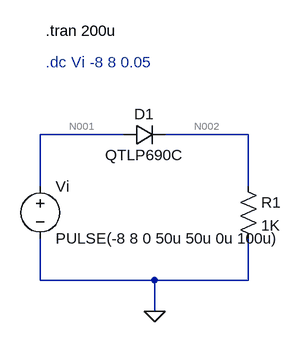
[diagram p0: schematic 114.asc]
114.asc, the LTspice schematic file:
Version 4.1
SHEET 1 880 680
WIRE 192 96 64 96
WIRE 384 96 256 96
WIRE 64 176 64 96
WIRE 384 176 384 96
WIRE 64 320 64 256
WIRE 240 320 64 320
WIRE 384 320 384 256
WIRE 384 320 240 320
WIRE 240 368 240 320
FLAG 240 368 0
SYMBOL diode 192 80 M90
WINDOW 0 0 32 VBottom 2
WINDOW 3 32 32 VTop 2
SYMATTR InstName D1
SYMATTR Value QTLP690C
SYMATTR Description Diode
SYMATTR Type diode
SYMBOL res 368 160 R0
SYMATTR InstName R1
SYMATTR Value 1K
SYMBOL voltage 64 160 R0
WINDOW 123 0 0 Left 0
WINDOW 39 0 0 Left 0
SYMATTR InstName Vi
SYMATTR Value PULSE(-8 8 0 50u 50u 0u 100u)
TEXT 72 -64 Left 2 !.tran 200u
TEXT 72 -16 Left 2 ;.dc Vi -8 8 0.05

The netlist it stands for:
* 114.asc
D1 N001 N002 QTLP690C
R1 N002 0 1K
Vi N001 0 PULSE(-8 8 0 50u 50u 0u 100u)
.model D D
.lib standard.dio
.tran 200u
* .dc Vi -8 8 0.05
.backanno
.end

* Results of the author's LTspice run, read from the files saved beside the schematic
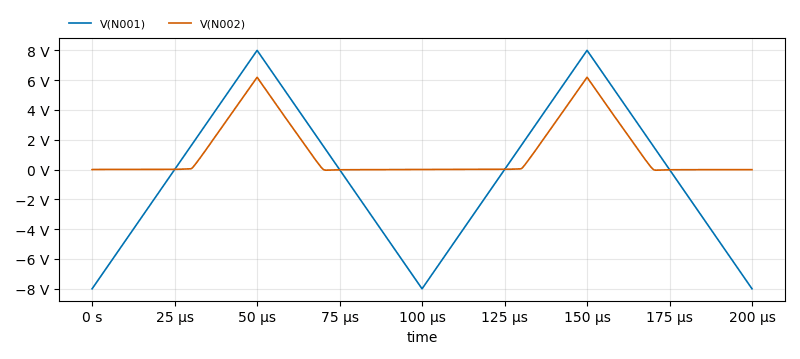
[diagram p1: Transient Analysis of 114.asc, plotted from the saved traces]
* Transient Analysis, 1 run:
*   V(N001): min -8 V, max 7.997 V, average -227.2 µV, rms 4.672 V, last -8 V
*   V(N002): min -42.04 mV, max 6.191 V, average 1.222 V, rms 2.319 V, last -5.337 mV